# Altium schematic sheet Tower Electronics Diagarm_2023-07-17.schdoc
size 256 x 189 mm
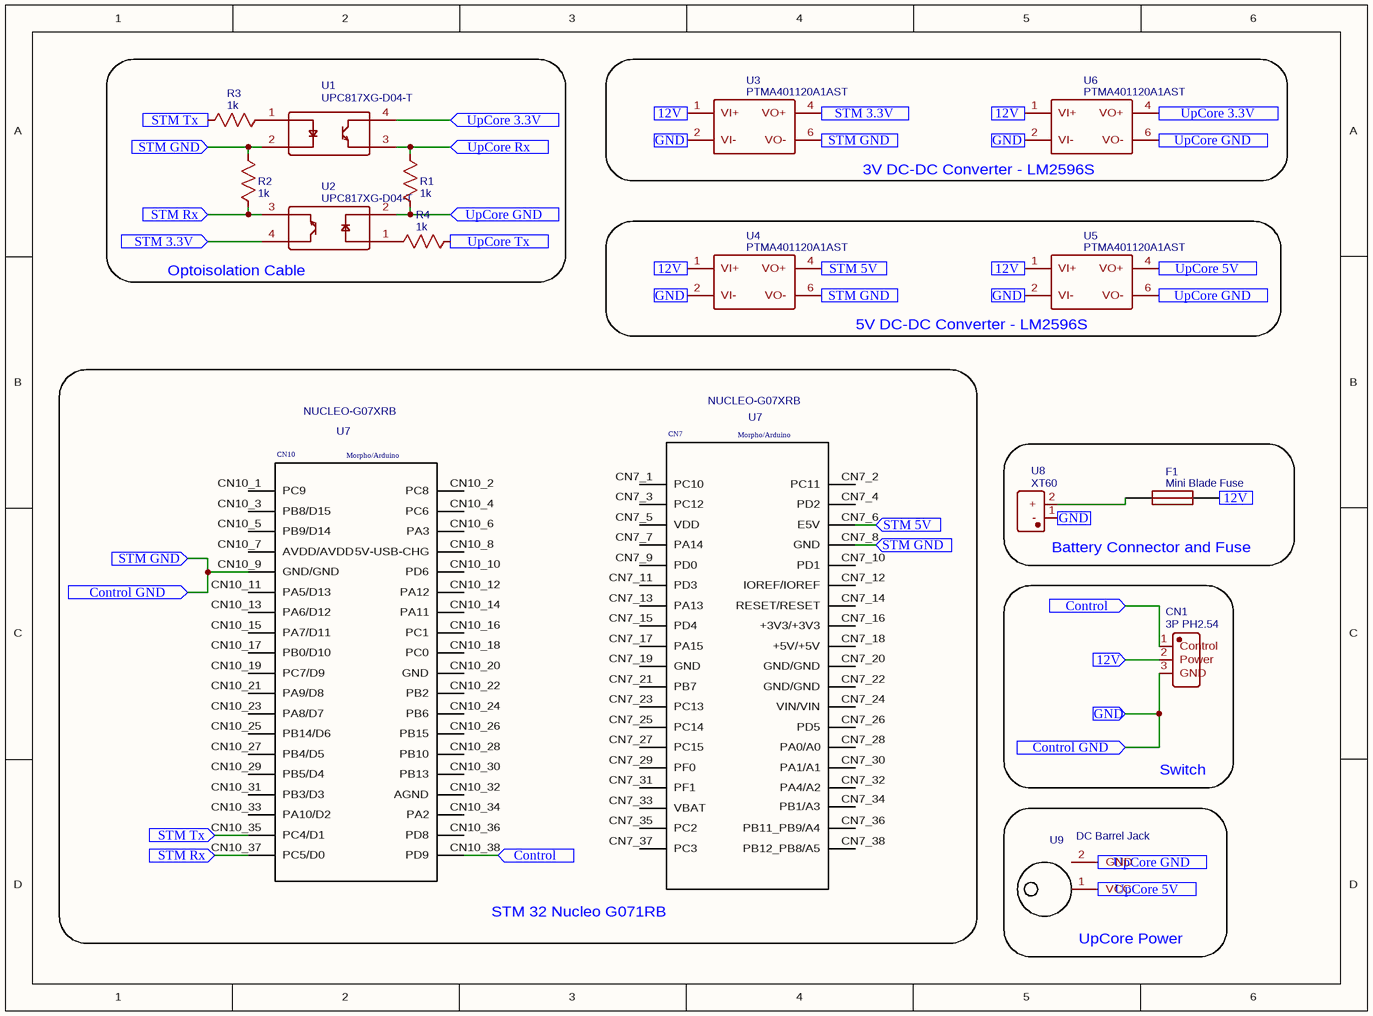
[diagram p0: Tower Electronics Diagarm_2023-07-17.schdoc]

## Parts
(Parts that share a designator on the sheet are numbered #1, #2 ... from top to bottom, then left to right.)
CN1  3P PH2.54  [CONN-TH_3P-P2.50_3PIN]
F1  Mini Blade Fuse  [MINI BLADE]
R1  1k  [R0603]
R2  1k  [R0603]
R3  1k  [R0603]
R4  1k  [R0603]
U1  UPC817XG-D04-T  [DIP-4_L4.6-W6.5-P2.54-LS7.6-BL]
U2  UPC817XG-D04-T  [DIP-4_L4.6-W6.5-P2.54-LS7.6-BL]
U3  PTMA401120A1AST  [TI-EET4_V]
U4  PTMA401120A1AST  [TI-EET4_V]
U5  PTMA401120A1AST  [TI-EET4_V]
U6  PTMA401120A1AST  [TI-EET4_V]
U7#1  NUCLEO-G07XRB  [*MODULE_NUCLEO-L053R8_NUCLEO-L053R8(PRIMARY)]
U7#2  NUCLEO-G07XRB  [*MODULE_NUCLEO-L053R8_NUCLEO-L053R8(PRIMARY)]
U8  XT60  [CONN-TH_XT60]
U9  DC Barrel Jack  [DC-BARREL-JACK-FEMALE-FOOTPRINT]

## Blocks framed on the sheet
Optoisolation Cable: R1-R4 U1 U2
3V DC-DC Converter - LM2596S: U3 U6
5V DC-DC Converter - LM2596S: U4 U5
STM 32 Nucleo G071RB: U7#1 U7#2
Battery Connector and Fuse: F1 U8
Switch: CN1
UpCore Power: U9

## Ports
12V (in), Control (in), Control GND (in), GND (in), STM 3.3V (in), STM 5V (in), STM GND (in), STM Rx (in), STM Tx (in), UpCore 3.3V (in), UpCore 5V (in), UpCore GND (in), UpCore Rx (in), UpCore Tx (in)

## Nets
12V: CN1.2(Power) F1.2 U3.1(VI+) U4.1(VI+) U5.1(VI+) U6.1(VI+) ; port 12V
Control: CN1.1(Control) U7#2.CN10_38(PD9) ; port Control
Control GND: CN1.3(GND) R2.2 U1.2(C) U3.2(VI-) U3.6(VO-) U4.2(VI-) U4.6(VO-) U5.2(VI-) U6.2(VI-) U7#1.CN7_8(GND) U7#2.CN10_9(GND/GND) U8.1(-) ; port STM GND, port GND, port Control GND
STM 3.3V: U2.4(COL) U3.4(VO+) ; port STM 3.3V
STM 5V: U4.4(VO+) U7#1.CN7_6(E5V) ; port STM 5V
STM Rx: R2.1 U2.3(EM) U7#2.CN10_37(PC5/D0) ; port STM Rx
STM Tx: R3.1 U7#2.CN10_35(PC4/D1) ; port STM Tx
UpCore 3.3V: U1.4(COL) U6.4(VO+) ; port UpCore 3.3V
UpCore 5V: U5.4(VO+) ; port UpCore 5V
UpCore GND: R1.1 U2.2(C) U5.6(VO-) U6.6(VO-) ; port UpCore GND
UpCore Rx: R1.2 U1.3(EM) ; port UpCore Rx
UpCore Tx: R4.2 ; port UpCore Tx
NetF1_1: F1.1 U8.2(+)
NetR3_2: R3.2 U1.1(A)
NetR4_1: R4.1 U2.1(A)

Not connected (* = marked no-connect by the designer): U7#1 CN7_1(PC10) CN7_2(PC11) CN7_3(PC12) CN7_4(PD2) CN7_5(VDD) CN7_7(PA14) CN7_9(PD0) CN7_10(PD1) CN7_11(PD3) CN7_12(IOREF/IOREF) CN7_13(PA13) CN7_14(RESET/RESET) CN7_15(PD4) CN7_16(+3V3/+3V3) CN7_17(PA15) CN7_18(+5V/+5V) CN7_19(GND) CN7_20(GND/GND) CN7_21(PB7) CN7_22(GND/GND) CN7_23(PC13) CN7_24(VIN/VIN) CN7_25(PC14) CN7_26(PD5) CN7_27(PC15) CN7_28(PA0/A0) CN7_29(PF0) CN7_30(PA1/A1) CN7_31(PF1) CN7_32(PA4/A2) CN7_33(VBAT) CN7_34(PB1/A3) CN7_35(PC2) CN7_36(PB11_PB9/A4) CN7_37(PC3) CN7_38(PB12_PB8/A5); U7#2 CN10_1(PC9) CN10_2(PC8) CN10_3(PB8/D15) CN10_4(PC6) CN10_5(PB9/D14) CN10_6(PA3) CN10_7(AVDD/AVDD) CN10_8(5V-USB-CHG) CN10_10(PD6) CN10_11(PA5/D13) CN10_12(PA12) CN10_13(PA6/D12) CN10_14(PA11) CN10_15(PA7/D11) CN10_16(PC1) CN10_17(PB0/D10) CN10_18(PC0) CN10_19(PC7/D9) CN10_20(GND) CN10_21(PA9/D8) CN10_22(PB2) CN10_23(PA8/D7) CN10_24(PB6) CN10_25(PB14/D6) CN10_26(PB15) CN10_27(PB4/D5) CN10_28(PB10) CN10_29(PB5/D4) CN10_30(PB13) CN10_31(PB3/D3) CN10_32(AGND) CN10_33(PA10/D2) CN10_34(PA2) CN10_36(PD8); U9 1(VCC) 2(GND)

## Notes on the sheet
- (in symbol NUCLEO-G07XRB) CN7; Morpho/Arduino; CN10

## Library data of the parts
CN1 = 3P PH2.54: Contributor: LCSC; BOM_Supplier: LCSC; BOM_Supplier Part: C9900006188; BOM_Manufacturer Part: 3P PH2.54; BOM_JLCPCB Part Class: Extended Part; spicePre: C; spiceSymbolName: 3P PH2.54
F1 = Mini Blade Fuse: Contributor: joe5656123; BOM_Manufacturer Part: Mini Blade Fuse; BOM_Supplier Part: F991-ND; BOM_Supplier: Digi-Key; link: http://www.littelfuse.com/~/media/automotive/datasheets/fuses/passenger-car-and-commercial-vehicle/blade-fuses/littelfuse_mini_datasheet.pdf; spicePre: F; spiceSymbolName: Mini Blade Fuse
R1-R4 = 1k: nameAlias: Value(Ω); Contributor: LCEDA_Lib; spicePre: R; spiceSymbolName: R_0603_US
U1 U2 = UPC817XG-D04-T: BOM_Manufacturer: UTC(友顺); Contributor: LCSC; BOM_Supplier: LCSC; BOM_Supplier Part: C2900479; BOM_Manufacturer Part: UPC817XG-D04-T; BOM_JLCPCB Part Class: Extended Part; spicePre: U; spiceSymbolName: UPC817XG-D04-T
U7#1 U7#2 = NUCLEO-G07XRB: mfgpart: Nucleo-F103RB; subpart_no: 1; mfgname: ST Microelectronics; Contributor: suraj_iipl; spicePre: U; spiceSymbolName: NUCLEO-G07XRB
U8 = XT60: BOM_Manufacturer: AMASS(艾迈斯); Contributor: lcsc; BOM_Supplier: LCSC; BOM_Supplier Part: C98733; BOM_Manufacturer Part: XT60; link: https://atta.szlcsc.com/upload/public/pdf/source/20170606/1496716524919.pdf; BOM_JLCPCB Part Class: Extended Part; spicePre: U; spiceSymbolName: XT60
U9 = DC Barrel Jack: Contributor: matwol97; spicePre: U; spiceSymbolName: DC Barrel Jack
U3-U6 = PTMA401120A1AST: spicePre: U; spiceSymbolName: PTMA401120A1AST